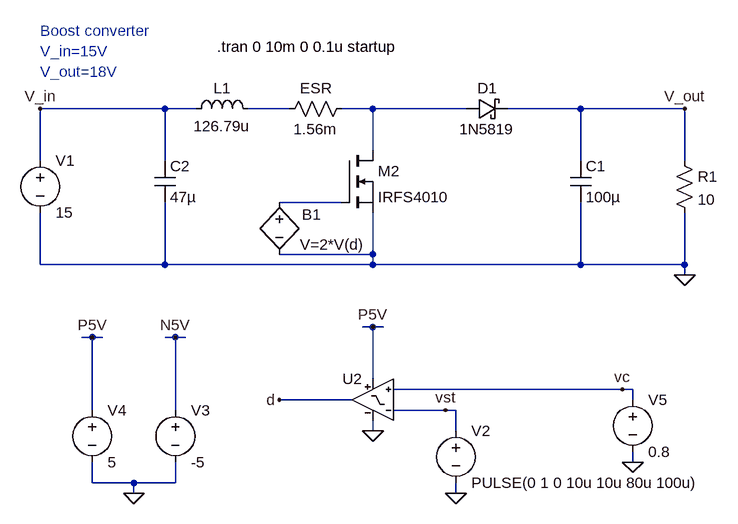
[diagram p0: schematic Boost_Converter_V0.asc]
Boost_Converter_V0.asc, the LTspice schematic file:
Version 4
SHEET 1 1332 1192
WIRE 240 304 48 304
WIRE 288 304 240 304
WIRE 432 304 368 304
WIRE 560 304 512 304
WIRE 704 304 560 304
WIRE 880 304 768 304
WIRE 1040 304 880 304
WIRE 560 368 560 304
WIRE 48 384 48 304
WIRE 240 384 240 304
WIRE 880 384 880 304
WIRE 1040 384 1040 304
WIRE 512 448 416 448
WIRE 560 528 560 464
WIRE 560 528 416 528
WIRE 48 544 48 464
WIRE 240 544 240 448
WIRE 240 544 48 544
WIRE 560 544 560 528
WIRE 560 544 240 544
WIRE 880 544 880 448
WIRE 880 544 560 544
WIRE 1040 544 1040 464
WIRE 1040 544 880 544
WIRE 1040 560 1040 544
WIRE 560 640 544 640
WIRE 576 640 560 640
WIRE 128 656 112 656
WIRE 144 656 128 656
WIRE 256 656 240 656
WIRE 272 656 256 656
WIRE 560 720 560 640
WIRE 944 736 592 736
WIRE 960 736 944 736
WIRE 528 752 416 752
WIRE 960 752 960 736
WIRE 128 768 128 656
WIRE 256 768 256 656
WIRE 672 768 592 768
WIRE 688 768 672 768
WIRE 560 800 560 784
WIRE 688 800 688 768
WIRE 960 848 960 832
WIRE 128 880 128 848
WIRE 192 880 128 880
WIRE 256 880 256 848
WIRE 256 880 192 880
WIRE 192 896 192 880
WIRE 688 896 688 880
FLAG 1040 560 0
FLAG 560 800 0
FLAG 688 896 0
FLAG 960 848 0
FLAG 416 752 d
FLAG 192 896 0
FLAG 944 736 vc
FLAG 672 768 vst
FLAG 560 640 P5V
FLAG 128 656 P5V
FLAG 256 656 N5V
FLAG 48 304 V_in
FLAG 1040 304 V_out
SYMBOL voltage 48 368 R0
SYMATTR InstName V1
SYMATTR Value 15
SYMBOL schottky 704 320 R270
WINDOW 0 32 32 VTop 2
WINDOW 3 0 32 VBottom 2
SYMATTR InstName D1
SYMATTR Value 1N5819
SYMATTR Description Diode
SYMATTR Type diode
SYMBOL ind 272 320 R270
WINDOW 0 32 56 VTop 2
WINDOW 3 5 56 VBottom 2
SYMATTR InstName L1
SYMATTR Value 126.79u
SYMBOL res 1024 368 R0
SYMATTR InstName R1
SYMATTR Value 10
SYMBOL cap 864 384 R0
SYMATTR InstName C1
SYMATTR Value 100µ
SYMBOL cap 224 384 R0
SYMATTR InstName C2
SYMATTR Value 47µ
SYMBOL voltage 688 784 R0
SYMATTR InstName V2
SYMATTR Value PULSE(0 1 0 10u 10u 80u 100u)
SYMBOL voltage 256 752 R0
SYMATTR InstName V3
SYMATTR Value -5
SYMBOL voltage 128 752 R0
SYMATTR InstName V4
SYMATTR Value 5
SYMBOL voltage 960 736 R0
SYMATTR InstName V5
SYMATTR Value 0.8
SYMBOL Ideal_Comparator 560 688 M0
SYMATTR InstName U2
SYMBOL nmos 512 368 R0
SYMATTR InstName M2
SYMATTR Value IRFS4010
SYMBOL bv 416 432 R0
WINDOW 0 35 35 Left 2
WINDOW 3 32 81 Left 2
SYMATTR InstName B1
SYMATTR Value V=2*V(d)
SYMBOL res 528 288 R90
WINDOW 0 0 56 VBottom 2
WINDOW 3 32 56 VTop 2
SYMATTR InstName ESR
SYMATTR Value 1.56m
TEXT 48 184 Left 2 ;Boost converter\nV_in=15V\nV_out=18V
TEXT 320 208 Left 2 !.tran 0 10m 0 0.1u startup

The netlist it stands for:
* Boost_Converter_V0.asc
V1 V_in 0 15
D1 N002 V_out 1N5819
L1 V_in N001 126.79u
R1 V_out 0 10
C1 V_out 0 100µ
C2 V_in 0 47µ
V2 vst 0 PULSE(0 1 0 10u 10u 80u 100u)
V3 N5V 0 -5
V4 P5V 0 5
V5 vc 0 0.8
XU2 vc vst P5V 0 d Ideal_Comparator  ; pins In+ In- pos neg out
M2 N002 N003 0 0 IRFS4010
B1 N003 0 V=2*V(d)
R§ESR N002 N001 1.56m
.model D D
.lib standard.dio
.model NMOS NMOS
.model PMOS PMOS
.lib standard.mos
* Boost converter
* V_in=15V
* V_out=18V
.tran 0 10m 0 0.1u startup
.lib Ideal_Comparator.sub
.backanno
.end

* Results of the author's LTspice run, read from the files saved beside the schematic
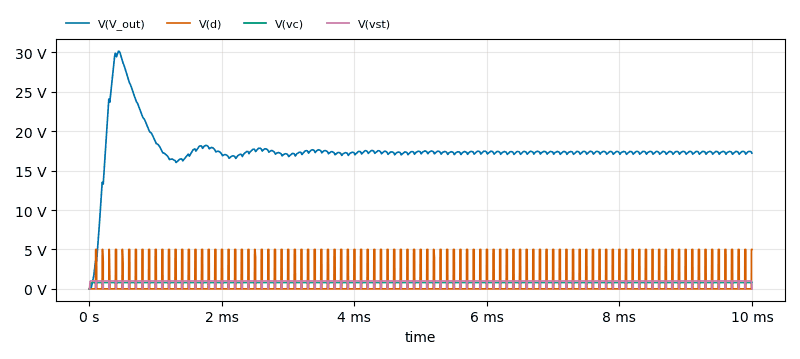
[diagram p1: Transient Analysis of Boost_Converter_V0.asc, plotted from the saved traces]
* Transient Analysis, 1 run:
*   V(V_out): min 0 V, max 30.18 V, average 17.61 V, rms 17.85 V, last 17.22 V
*   V(d): min 0 V, max 5 V, average 796 mV, rms 1.994 V, last 5 V
*   V(vc): min 0 V, max 800 mV, average 799.2 mV, rms 799.5 mV, last 800 mV
*   V(vst): min 0 V, max 1 V, average 900 mV, rms 937.1 mV, last 0 V